# EAGLE design S3860M-S (EAGLE 7.1.0)
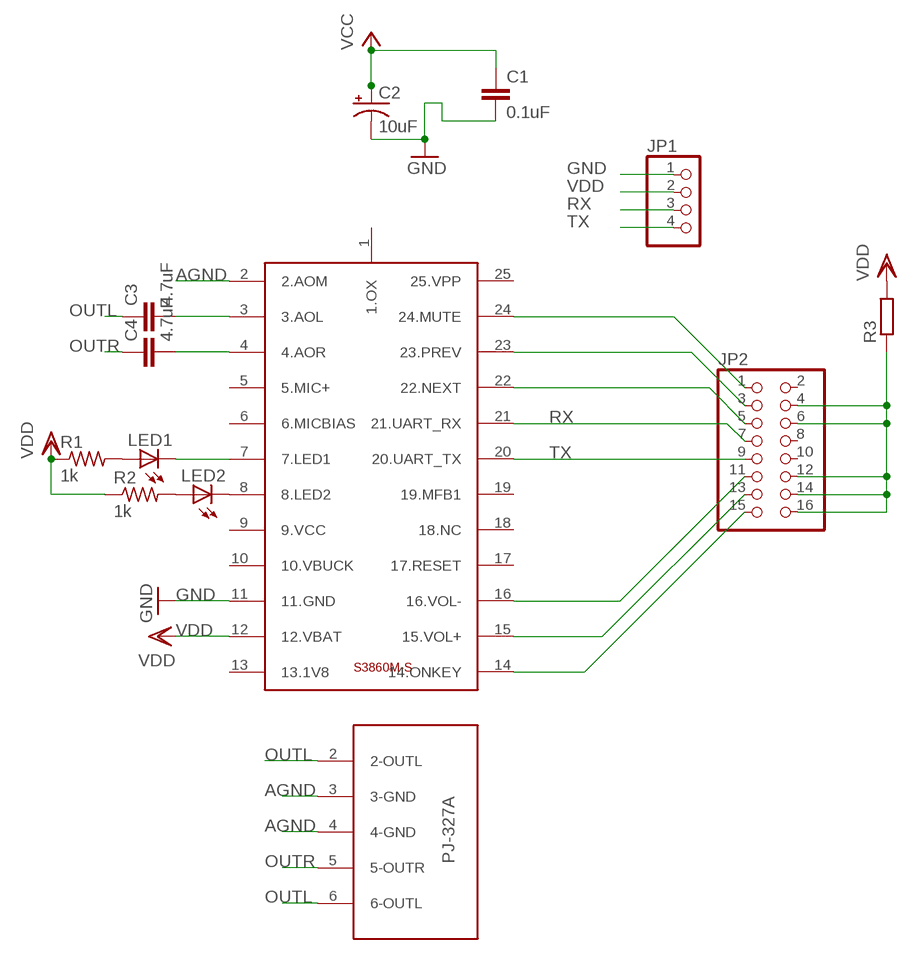
[diagram p0: schematic, sheet 1]

## Parts
C1  0.1uF  10UF-6.3V-20%(1206)  [1206]
C2  10uF  CAP_POLE  [PANASONIC_E]
C3  4.7uF  C-EUC1206  [C1206]
C4  4.7uF  C-EUC1206  [C1206]
JP1  PINHD-1X4  [1X04]
JP2  PINHD-2X8  [2X08]
LED1  LEDCHIPLED_0805  [CHIPLED_0805]
LED2  LEDCHIPLED_0805  [CHIPLED_0805]
R1  1k  R-US_R1206  [R1206]
R2  1k  R-US_R1206  [R1206]
R3  R-EU_M1206  [M1206]
U$1  S3860M-S  [S3860M-S]
U$2  PJ-327A  [PJ-327A]

## Nets
AGND: U$1.2(2.AOM) U$2.3(3-GND) U$2.4(4-GND)
GND: C1.2 C2.- JP1.1 U$1.11(11.GND)
N$1: LED2.A R2.2
N$2: JP2.15 U$1.14(14.ONKEY)
N$3: LED1.C U$1.7(7.LED1)
N$4: LED2.C U$1.8(8.LED2)
N$5: LED1.A R1.2
N$6: JP2.13 U$1.15(15.VOL+)
N$7: JP2.11 U$1.16(16.VOL-)
N$8: JP2.1 U$1.24(24.MUTE)
N$9: JP2.3 U$1.23(23.PREV)
N$10: C4.2 U$1.4(4.AOR)
N$11: C3.2 U$1.3(3.AOL)
N$12: JP2.5 U$1.22(22.NEXT)
N$13: JP2.4 JP2.6 JP2.12 JP2.14 JP2.16 R3.1
OUTL: C3.1 U$2.2(2-OUTL) U$2.6(6-OUTL)
OUTR: C4.1 U$2.5(5-OUTR)
RX: JP1.3 JP2.7 U$1.21(21.UART_RX)
TX: JP1.4 JP2.9 U$1.20(20.UART_TX)
VCC: C1.1 C2.+
VDD: JP1.2 R1.1 R2.1 R3.2 U$1.12(12.VBAT)
Unconnected: JP2.2 JP2.8 JP2.10 U$1.1(1.OX) U$1.5(5.MIC+) U$1.6(6.MICBIAS) U$1.9(9.VCC) U$1.10(10.VBUCK) U$1.13(13.1V8) U$1.17(17.RESET) U$1.18(18.NC) U$1.19(19.MFB1) U$1.25(25.VPP)

## Library data of the parts
C1 = SparkFun-Capacitors:10UF-6.3V-20%(1206): Ceramic CAP-10057; PROD_ID: CAP-10057; VALUE: 10uF
C2 = SparkFun-Capacitors:CAP_POL: Capacitor Polarized These are standard SMD and PTH capacitors. Normally 10uF, 47uF, and 100uF in electrolytic and tantalum varieties. Always verify the external diameter of the through hole cap, it varies with capacity, voltage, and manufacturer. The EIA devices should be standard.
C3 C4 = rcl:C-EU: CAPACITOR, European symbol
JP1 = pinhead:PINHD-1X4: PIN HEADER
JP2 = pinhead:PINHD-2X8: PIN HEADER
LED1 LED2 = adafruit:LED: LED OSRAM: - CHIPLED LG R971, LG N971, LY N971, LG Q971, LY Q971, LO R971, LY R971 LH N974, LH R974 LS Q976, LO Q976, LY Q976 LO Q996 - Hyper CHIPLED LW Q18S LB Q993, LB Q99A, LB R99A - SideLED LS A670, LO A670, LY A670, LG A670, LP A670 LB A673, LV A673, LT A673, LW A673 LH A674 LY A675 LS A676, LA A676, LO A676, LY A676, LW A676 LS A679, LY A679, LG A679 - Hyper Micro SIDELED® LS Y876, LA Y876, LO Y876, LY Y876 LT Y87S - SmartLED LW L88C, LW L88S LB L89C, LB L89S, LG L890 LS L89K, LO L89K, LY L89K LS L896, LA L896, LO L896, LY L896 - TOPLED LS T670, LO T670, LY T670, LG T670, LP T670 LSG T670, LSP T670, LSY T670, LOP T670, LYG T670 LG T671, LOG T671, LSG T671 LB T673, LV T673, LT T673, LW T673 LH T674 LS T676, LA T676, LO T676, LY T676, LB T676, LH T676, LSB T676, LW T676 LB T67C, LV T67C, LT T67C, LS T67K, LO T67K, LY T67K, LW E67C LS E67B, LA E67B, LO E67B, LY E67B, LB E67C, LV E67C, LT E67C LW T67C LS T679, LY T679, LG T679 LS T770, LO T770, LY T770, LG T770, LP T770 LB T773, LV T773, LT T773, LW T773 LH T774 LS E675, LA E675, LY E675, LS T675 LS T776, LA T776, LO T776, LY T776, LB T776 LHGB T686 LT T68C, LB T68C - Hyper Mini TOPLED® LB M676 - Mini TOPLED Santana® LG M470 LS M47K, LO M47K, LY M47K Source: http://www.osram.convergy.de/
R1 R2 = adafruit:R-US_: RESISTOR, American symbol
R3 = rcl:R-EU_: RESISTOR, European symbol
U$1 = S3860M-S:S3860M-S
U$2 = PJ-327A:PJ-327A

## Board
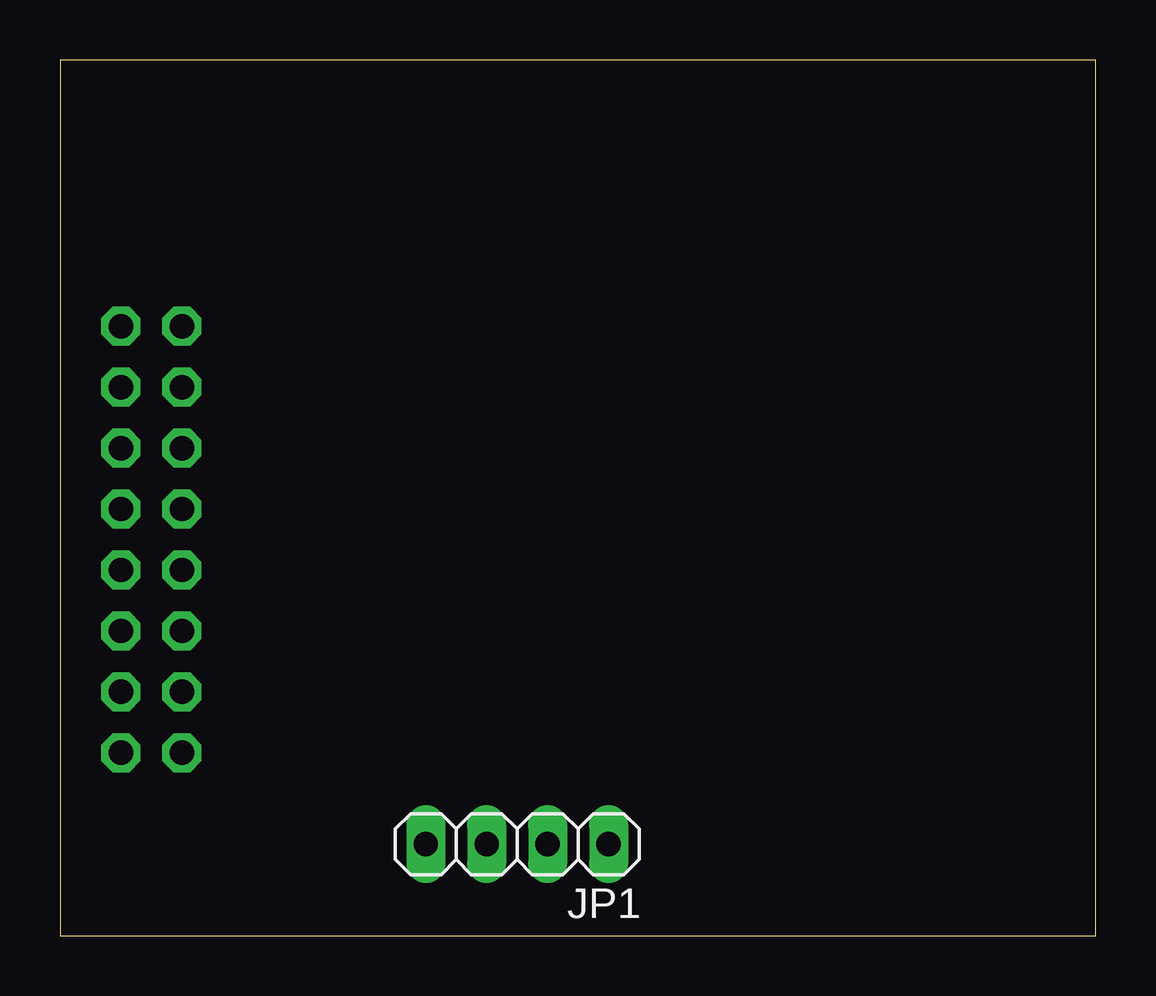
[diagram p1: board, top side]
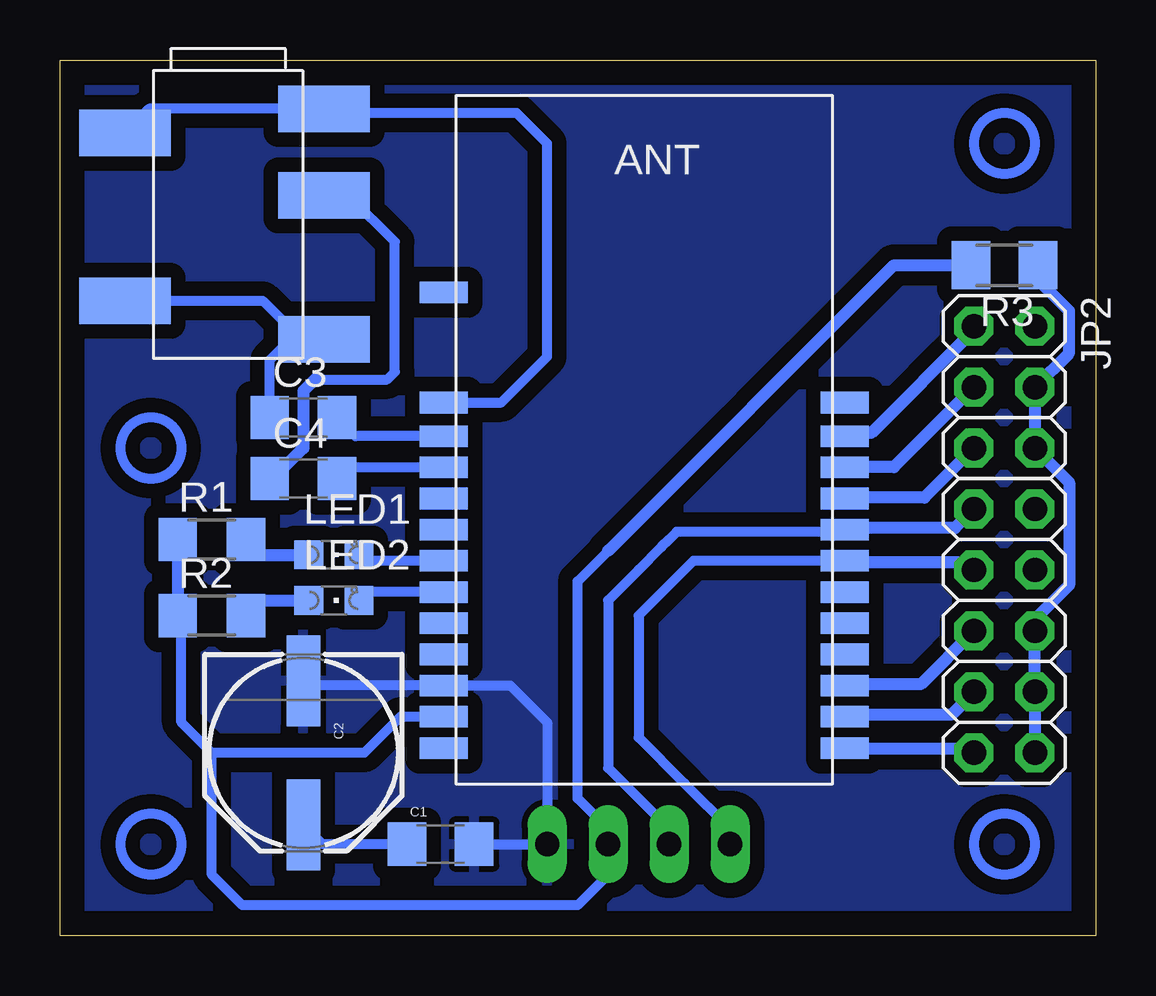
[diagram p2: board, bottom side, seen from below]

Size 43.16 x 36.5 mm. Coordinates in mm from the lower left corner, seen from the top.
Outline: 0,0 43.16,0 43.16,36.5 0,36.5 0,0
Copper layers (1*16): Top 0.035mm / dielectric 1.5mm / Bottom 0.035mm
Design rules "default": minimum track width 20mil, minimum drill 32mil, track to track 12mil, track to pad 12mil, pad to pad 12mil, via to via 12mil, smd to smd 12mil, copper to edge 40mil, drill to drill 40mil, minimum pad ring 12mil, minimum via ring 12mil, stop-mask expansion 4mil, vias tented up to drill 0mil, thermal gap 10mil

### Footprints (pad centres in the part's own frame; a part is rotated, then mirrored left to right if it is on the bottom)
1206 = smd 1.6 x 1.8: 1 -1.4,0; 2 1.4,0
PANASONIC_E = smd 3.8 x 1.4: + 3,0; - -3,0
C1206 = smd 1.6 x 1.8: 1 -1.4,0; 2 1.4,0
1X04 = drill 1.016 long: 1 -3.81,0; 2 -1.27,0; 3 1.27,0; 4 3.81,0
2X08 = drill 1.016 octagon: 1 -8.89,-1.27; 2 -8.89,1.27; 3 -6.35,-1.27; 4 -6.35,1.27; 5 -3.81,-1.27; 6 -3.81,1.27; 7 -1.27,-1.27; 8 -1.27,1.27; 9 1.27,-1.27; 10 1.27,1.27; 11 3.81,-1.27; 12 3.81,1.27; 13 6.35,-1.27; 14 6.35,1.27; 15 8.89,-1.27; 16 8.89,1.27
CHIPLED_0805 = smd 1.2 x 1.2: A 0,-1.05; C 0,1.05
R1206 = smd 1.6 x 1.803: 1 -1.422,0; 2 1.422,0
M1206 = smd 1.6 x 2: 1 -1.4,0; 2 1.4,0
S3860M-S = smd 2 x 0.9: 1 -0.5,-6.2; 2 -0.5,-10.8; 3 -0.5,-12.2; 4 -0.5,-13.5; 5 -0.5,-14.8; 6 -0.5,-16.1; 7 -0.5,-17.4; 8 -0.5,-18.7; 9 -0.5,-20; 10 -0.5,-21.3; 11 -0.5,-22.6; 12 -0.5,-23.9; 13 -0.5,-25.2; 14 16.2,-25.2; 15 16.2,-23.9; 16 16.2,-22.6; 17 16.2,-21.3; 18 16.2,-20; 19 16.2,-18.7; 20 16.2,-17.4; 21 16.2,-16.1; 22 16.2,-14.8; 23 16.2,-13.5; 24 16.2,-12.2; 25 16.2,-10.8
PJ-327A = smd 1.93 x 3.81: 2 9.1,-6.8; 3 2.1,-6.8; 4 1.1,1.5; 5 4.7,1.5; 6 10.7,1.5

### Placement (x,y rotation side)
C1  27.3,3.81 0 bottom
C2  33.02,7.62 270 bottom
C3  33.02,21.59 0 bottom
C4  33.02,19.05 0 bottom
JP1  19.05,3.81 180 top
JP2  3.81,16.51 270 bottom
LED1  31.75,15.88 270 bottom
LED2  31.75,13.97 270 bottom
R1  36.83,16.51 0 bottom
R2  36.83,13.34 0 bottom
R3  3.81,27.94 180 bottom
U$1  26.67,33.02 0 bottom
U$2  33.66,35.56 270 bottom

### Tracks (layer width: path | path; a pad name or v marks a point on that pad's centre or on a via)
AGND
  Bottom 0.406: 27.15,22.23 24.77,22.23 22.86,24.13 22.86,33.02 24.13,34.29 30.71,34.29 U$2.4 39.45,34.46 U$2.3
  Bottom 0.508: 27.15,22.23 U$1.2 | 30.8,34.45 U$2.4
GND
  Bottom 0.406: C2.- 32.82,10.42 U$1.11 24.39,10.42 22.86,8.89 JP1.1 C1.2
  pour Bottom (isolate 0.61): 0,36.83 43.18,36.83 43.18,0 0,0
N$1
  Bottom 0.508: LED2.A 32.86,13.97 34.77,13.97 R2.2
N$2
  Bottom 0.508: JP2.15 5.24,7.78 10.32,7.78 U$1.14
N$3
  Bottom 0.406: U$1.7 30.45,15.62 LED1.C
N$4
  Bottom 0.406: U$1.8 30.35,14.32 LED2.C
N$5
  Bottom 0.508: LED1.A 32.86,15.88 34.77,15.88 R1.2
N$6
  Bottom 0.508: JP2.13 6.03,9.21 10.32,9.21 U$1.15
N$7
  Bottom 0.508: JP2.11 7.3,10.48 10.32,10.48 U$1.16
N$8
  Bottom 0.508: JP2.1 5.08,25.24 9.37,20.95 10.32,20.95 U$1.24
N$9
  Bottom 0.508: JP2.3 8.41,19.53 10.32,19.53 U$1.23
N$10
  Bottom 0.406: U$1.4 31.15,19.52 C4.2
N$11
  Bottom 0.406: U$1.3 30.85,20.82 C3.2
N$12
  Bottom 0.508: JP2.5 7.14,18.26 10.32,18.26 U$1.22
N$13
  Bottom 0.508: JP2.16 JP2.14 2.54,10.32 JP2.12 2.38,12.86 2.38,13.34 1.11,14.61 1.11,18.89 2.38,20.16 JP2.6 2.54,22.7 JP2.4 1.11,24.29 1.11,26.04 2.38,27.3 2.38,27.94 R3.1
OUTL
  Bottom 0.406: C3.1 34.42,24 33.02,25.4 32.7,25.4 | 32.7,25.4 U$2.6 32.7,25.4 | U$2.2 34.72,26.46 33.66,25.4 32.7,25.4
OUTR
  Bottom 0.406: 32.54,23.18 29.53,23.18 29.21,23.5 29.21,28.92 31.1,30.81
  Bottom 0.508: 32.54,23.18 33.02,22.7 33.02,20.32 34.29,19.05 C4.1 | 31.43,30.8 30.8,30.8 31.1,30.81 U$2.5
RX
  Bottom 0.406: JP1.3 17.78,4.45 20.32,6.99 20.32,13.97 19.05,15.24 18.1,16.19 | 18.1,16.19 17.78,16.51 | 10.64,16.83 17.46,16.83 18.1,16.19
  Bottom 0.508: JP2.7 5.87,16.99 10.32,16.99 U$1.21 10.64,16.83
TX
  Bottom 0.406: 15.24,4.45 JP1.4 15.24,4.45 | U$1.20 16.77,15.62 17.14,15.24 17.78,14.61 19.05,13.34 19.05,8.26 17.14,6.35 15.24,4.45
  Bottom 0.508: JP2.9 5.4,15.56 10.32,15.56 U$1.20
VCC
  Bottom 0.406: C1.1 32.21,3.81 C2.+
VDD
  Bottom 0.406: U$1.12 28.98,9.12 30.48,7.62 36.83,7.62 | 36.83,7.62 38.1,8.89 38.1,13.81 38.26,13.97 | 36.83,7.62 36.83,2.54 35.56,1.27 21.59,1.27 20.32,2.54 JP1.2 20.32,4.45 21.59,5.71 21.59,14.76 20.32,16.03
  Bottom 0.508: R2.1 38.26,13.97 R1.1 | 20.32,16.03 8.41,27.94 5.24,27.94 R3.2
(copper drawn outside any net)
  shapes: Bottom circle x4